# Altium project Prueba.PrjPcb
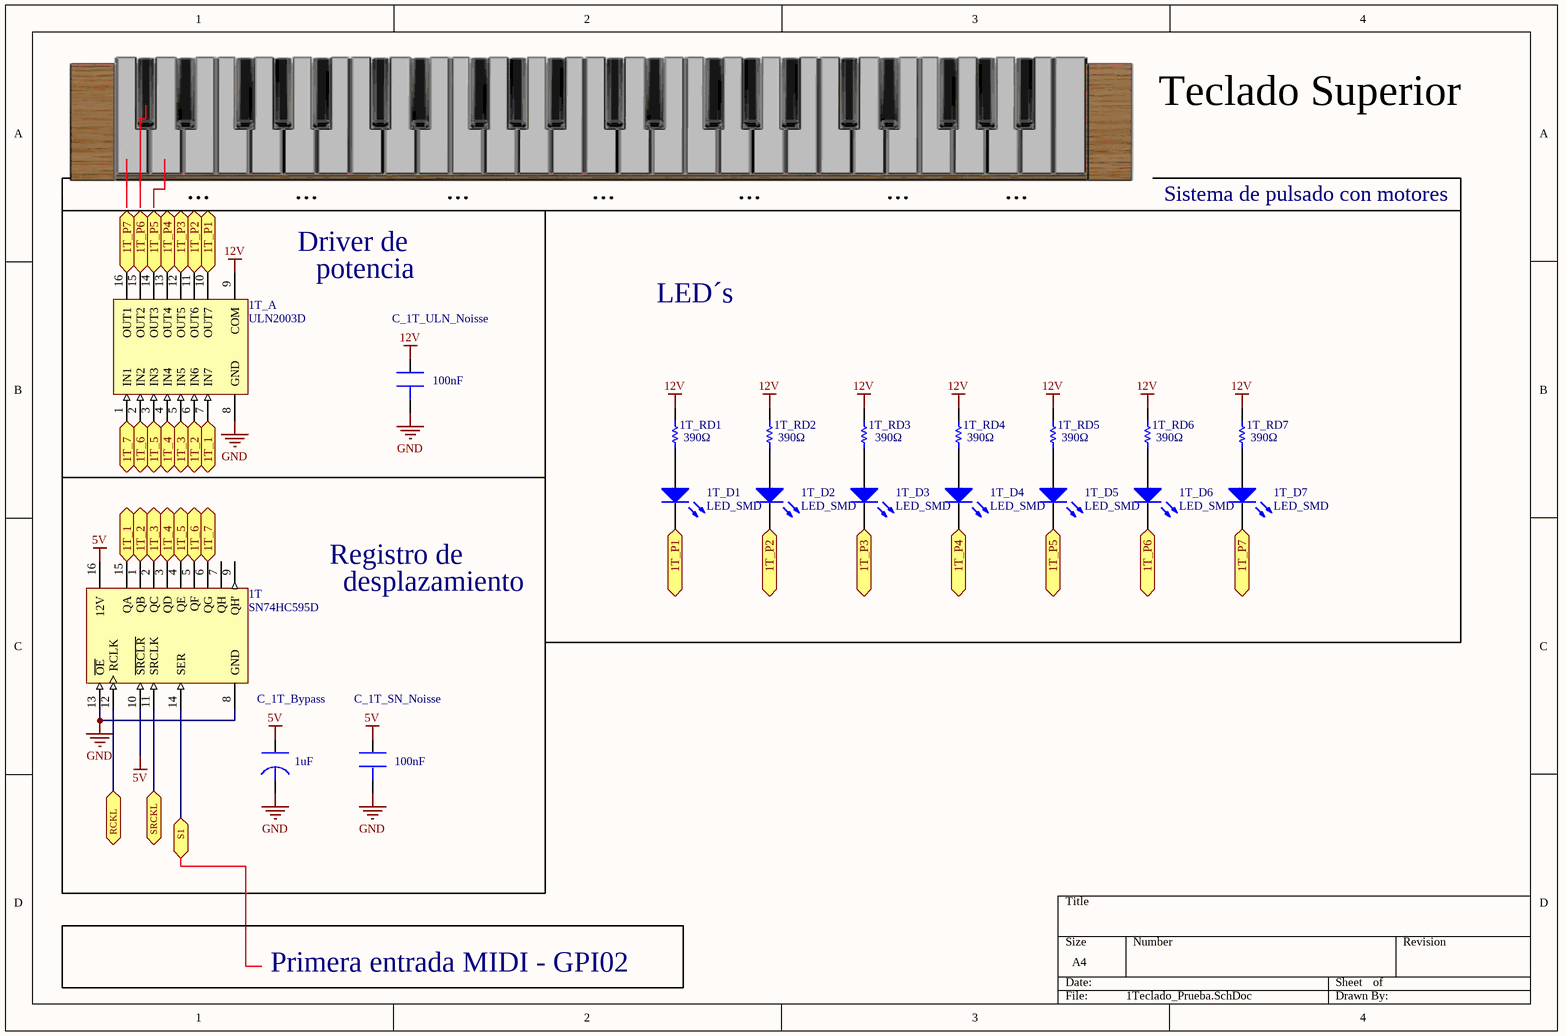
[diagram p0: 1Teclado_Prueba.SchDoc]
6 sheets, 91 parts. Net scope: flat (ports and power ports of the same name join across sheets).
Board file: PCB_Organo_Prueba_V3.PcbDoc
Sheets:
  1Teclado_Prueba.SchDoc
  2Teclado_Prueba.SchDoc
  Valvulas_Prueba.SchDoc
  Pedal_Prueba.SchDoc
  Externos_prueba.SchDoc
  GPIO_Raspberry_b+.SchDoc

## Sheet 1Teclado_Prueba.SchDoc
size A4

### Parts
1T  SN74HC595D  [SN74HC595D]
1T_A  ULN2003D  [ULN2003AI]
1T_D1  LED_SMD  [LED_0805]
1T_D2  LED_SMD  [LED_0805]
1T_D3  LED_SMD  [LED_0805]
1T_D4  LED_SMD  [LED_0805]
1T_D5  LED_SMD  [LED_0805]
1T_D6  LED_SMD  [LED_0805]
1T_D7  LED_SMD  [LED_0805]
1T_RD1  value 390Ω  [Resistencia_0805_N]  (hidden comment: Res Chip 0805)
1T_RD2  value 390Ω  [Resistencia_0805_N]  (hidden comment: Res Chip 0805)
1T_RD3  value 390Ω  [Resistencia_0805_N]  (hidden comment: Res Chip 0805)
1T_RD4  value 390Ω  [Resistencia_0805_N]  (hidden comment: Res Chip 0805)
1T_RD5  value 390Ω  [Resistencia_0805_N]  (hidden comment: Res Chip 0805)
1T_RD6  value 390Ω  [Resistencia_0805_N]  (hidden comment: Res Chip 0805)
1T_RD7  value 390Ω  [Resistencia_0805_N]  (hidden comment: Res Chip 0805)
C_1T_Bypass  value 1uF  [Panasonic B Size]  (hidden comment: Panasonic 1uF)
C_1T_SN_Noisse  value 100nF  [AVX Carcasa 1.206]  (hidden comment: AVX 100nF)
C_1T_ULN_Noisse  value 100nF  [AVX Carcasa 1.206]  (hidden comment: AVX 100nF)

### Ports
1T_1, 1T_2, 1T_3, 1T_4, 1T_5, 1T_6, 1T_7, 1T_P1, 1T_P2, 1T_P3, 1T_P4, 1T_P5, 1T_P6, 1T_P7, RCKL, S1, SRCKL

### Nets
5V: 1T.10(~{SRCLR}) 1T.16(12V) C_1T_Bypass.1 C_1T_SN_Noisse.1
12V: 1T_A.9(COM) 1T_RD1.2 1T_RD2.2 1T_RD3.2 1T_RD4.2 1T_RD5.2 1T_RD6.2 1T_RD7.2 C_1T_ULN_Noisse.1
GND: 1T.8(GND) 1T.13(~{OE}) 1T_A.8(GND) C_1T_Bypass.2 C_1T_SN_Noisse.2 C_1T_ULN_Noisse.2
Net1T_1: 1T.1(QB) 1T_A.6(IN6) ; port 1T_2
Net1T_2: 1T.2(QC) 1T_A.5(IN5) ; port 1T_3
Net1T_3: 1T.3(QD) 1T_A.4(IN4) ; port 1T_4
Net1T_4: 1T.4(QE) 1T_A.3(IN3) ; port 1T_5
Net1T_5: 1T.5(QF) 1T_A.2(IN2) ; port 1T_6
Net1T_6: 1T.6(QG) 1T_A.1(IN1) ; port 1T_7
Net1T_11: 1T.11(SRCLK) ; port SRCKL
Net1T_12: 1T.12(RCLK) ; port RCKL
Net1T_14: 1T.14(SER) ; port S1
Net1T_15: 1T.15(QA) 1T_A.7(IN7) ; port 1T_1
Net1T_A_10: 1T_A.10(OUT7) 1T_D1.2(K) ; port 1T_P1
Net1T_A_11: 1T_A.11(OUT6) 1T_D2.2(K) ; port 1T_P2
Net1T_A_12: 1T_A.12(OUT5) 1T_D3.2(K) ; port 1T_P3
Net1T_A_13: 1T_A.13(OUT4) 1T_D4.2(K) ; port 1T_P4
Net1T_A_14: 1T_A.14(OUT3) 1T_D5.2(K) ; port 1T_P5
Net1T_A_15: 1T_A.15(OUT2) 1T_D6.2(K) ; port 1T_P6
Net1T_A_16: 1T_A.16(OUT1) 1T_D7.2(K) ; port 1T_P7
Net1T_D1_1: 1T_D1.1(A) 1T_RD1.1
Net1T_D2_1: 1T_D2.1(A) 1T_RD2.1
Net1T_D3_1: 1T_D3.1(A) 1T_RD3.1
Net1T_D4_1: 1T_D4.1(A) 1T_RD4.1
Net1T_D5_1: 1T_D5.1(A) 1T_RD5.1
Net1T_D6_1: 1T_D6.1(A) 1T_RD6.1
Net1T_D7_1: 1T_D7.1(A) 1T_RD7.1

Not connected (* = marked no-connect by the designer): 1T 7(QH) 9(QH')

### Notes on the sheet
- Teclado Superior
- ...
- Sistema de pulsado con motores
- Driver de
- potencia
- LED´s
- Registro de
- desplazamiento
- Primera entrada MIDI - GPI02

### Library data of the parts
1T = SN74HC595D: 8-Bit Shift Register with 3-State Output Registers; Published: 8-Jun-2000; LatestRevisionDate: 13-Apr-2006; LatestRevisionNote: IPC-7351 Footprint Added.; DatasheetVersion: May-1997; PackageVersion: Jan-1998; PackageReference: D016; Publisher: Altium Limited; PackageDescription: 16-Pin Small Outline Integrated Circuit 1.27 mm Pitch; Code_IPC: SOIC127P600-16; ComponentLink1Description: Manufacturer Link; ComponentLink1URL: http://www.ti.com/; ComponentLink2Description: Datasheet; ComponentLink2URL: http://www-s.ti.com/sc/ds/sn74hc595.pdf
1T_A = ULN2003D: Seven Darlington Array; Published: 8-Jun-2000; LatestRevisionDate: 13-Apr-2006; LatestRevisionNote: IPC-7351 Footprint Added.; DatasheetVersion: Sep-1998; PackageVersion: May-1998; PackageReference: SO16; Publisher: Altium Limited; PackageDescription: 16-Pin Small Outline Integrated Circuit 1.27 mm Pitch; Code_IPC: SOIC127P600-16; ComponentLink1Description: Manufacturer Link; ComponentLink1URL: http://www.st.com/; ComponentLink2Description: Datasheet; ComponentLink2URL: http://www.st.com/stonline/products/literature/ds/5279/uln2001.pdf
1T_D1-1T_D7 = LED_SMD: LED SMD; Published: 8-Jun-2000; LatestRevisionDate: 08-Jul-2005; LatestRevisionNote: Mech Layer 1 removed.; PackageReference: LED-0; Publisher: Altium Limited
1T_RD1-1T_RD7 = Resistencia: Published: 8-Jun-2000; LatestRevisionDate: 17-Jul-2002; LatestRevisionNote: Re-released for DXP Platform.; PackageReference: AXIAL-0.3; Publisher: Altium Limited; PackageDescription: Axial Device, Thru-Hole; 2 Leads; 0.3 in Pin Spacing
C_1T_Bypass = Panasonic 1uF: Condensador Electrolítico SMD; Manufacturer #1: Nippon Chemi-Con; Part Number: EMV-500ADA101MJA0G; Tolerance: 20%; Ref. Mafero: 230; Voltage Rating: 50V; PCB DECAL: Panasonic B; Author: Jaime Jiménez Ortega; Cost: 0,718€; Date: 21/05/2009; Distributor: RS; Ref Distributor: 5479063
C_1T_SN_Noisse C_1T_ULN_Noisse = AVX 100nF: Condensador Cerámico SMD; Manufacturer #1: Nippon Chemi-Con; Part Number: EMV-500ADA101MJA0G; Tolerance: 20%; Ref. Mafero: 230; Voltage Rating: 50V; Author: Jaime Jiménez Ortega; Cost: 0,718€; Date: 21/05/2009; Distributor: RS; Ref Distributor: 5479063; PCB DECAL: AVX 1206

## Sheet 2Teclado_Prueba.SchDoc
size A4
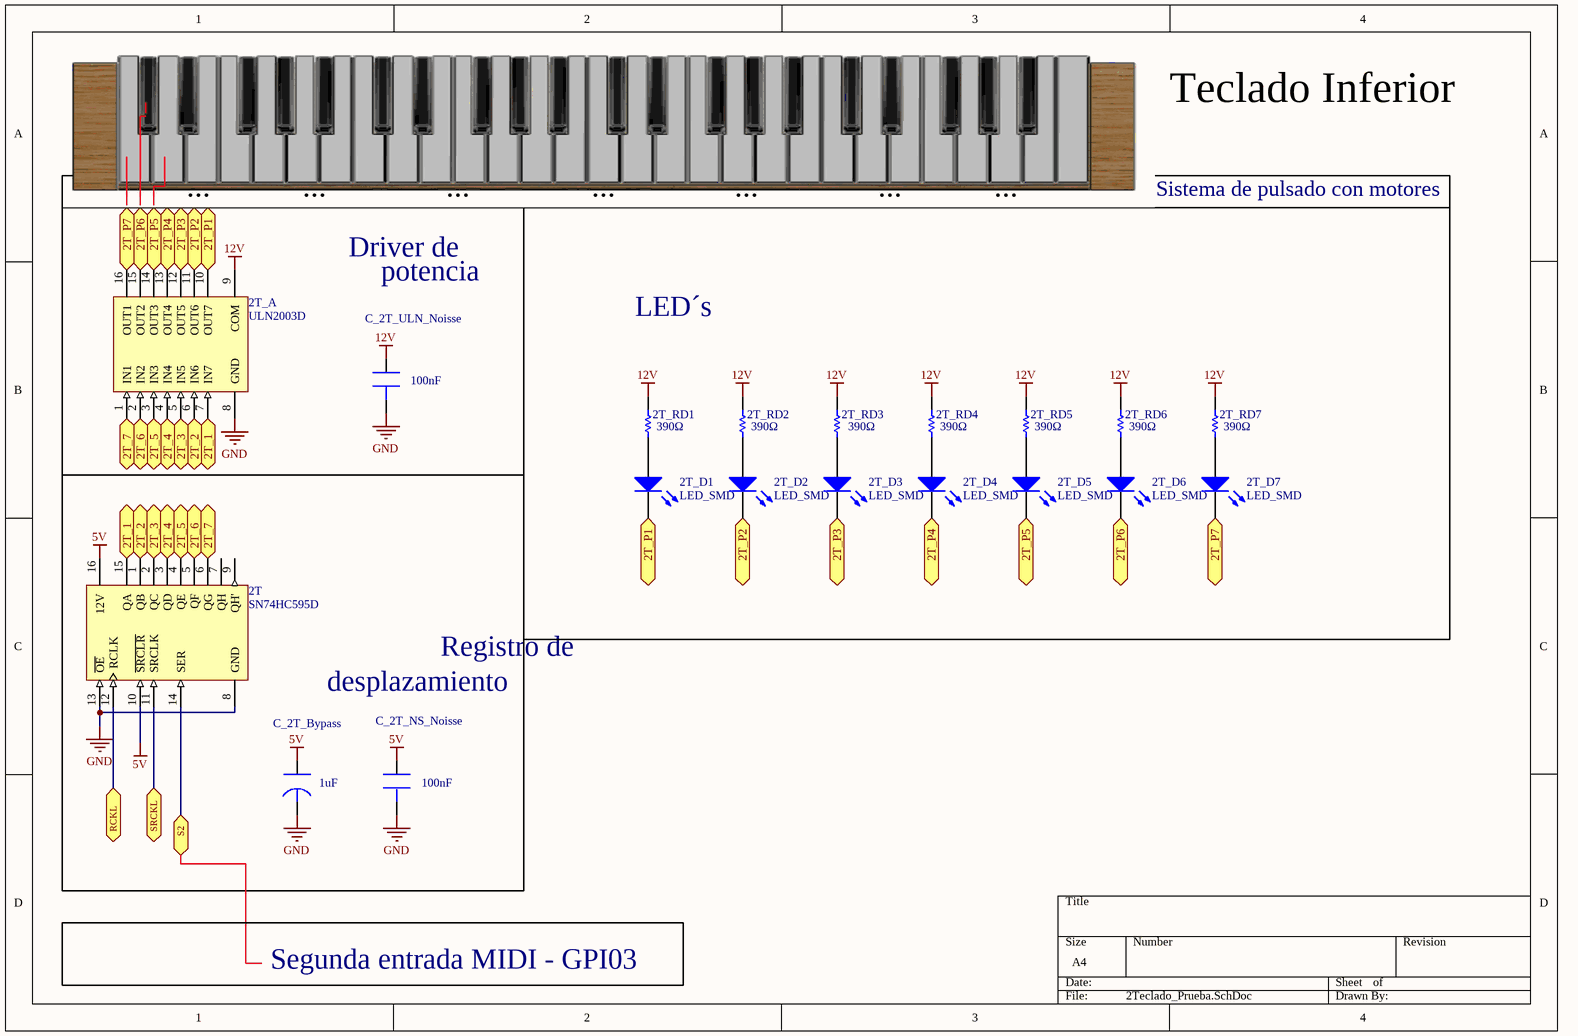
[diagram p1: 2Teclado_Prueba.SchDoc]

### Parts
2T  SN74HC595D  [SN74HC595D]
2T_A  ULN2003D  [ULN2003AI]
2T_D1  LED_SMD  [LED_0805]
2T_D2  LED_SMD  [LED_0805]
2T_D3  LED_SMD  [LED_0805]
2T_D4  LED_SMD  [LED_0805]
2T_D5  LED_SMD  [LED_0805]
2T_D6  LED_SMD  [LED_0805]
2T_D7  LED_SMD  [LED_0805]
2T_RD1  value 390Ω  [Resistencia_0805_N]  (hidden comment: Res Chip 0805)
2T_RD2  value 390Ω  [Resistencia_0805_N]  (hidden comment: Res Chip 0805)
2T_RD3  value 390Ω  [Resistencia_0805_N]  (hidden comment: Res Chip 0805)
2T_RD4  value 390Ω  [Resistencia_0805_N]  (hidden comment: Res Chip 0805)
2T_RD5  value 390Ω  [Resistencia_0805_N]  (hidden comment: Res Chip 0805)
2T_RD6  value 390Ω  [Resistencia_0805_N]  (hidden comment: Res Chip 0805)
2T_RD7  value 390Ω  [Resistencia_0805_N]  (hidden comment: Res Chip 0805)
C_2T_Bypass  value 1uF  [Panasonic B Size]  (hidden comment: Panasonic 1uF)
C_2T_NS_Noisse  value 100nF  [AVX Carcasa 1.206]  (hidden comment: AVX 100nF)
C_2T_ULN_Noisse  value 100nF  [AVX Carcasa 1.206]  (hidden comment: AVX 100nF)

### Ports
2T_1, 2T_2, 2T_3, 2T_4, 2T_5, 2T_6, 2T_7, 2T_P1, 2T_P2, 2T_P3, 2T_P4, 2T_P5, 2T_P6, 2T_P7, RCKL, S2, SRCKL

### Nets
5V: 2T.10(~{SRCLR}) 2T.16(12V) C_2T_Bypass.1 C_2T_NS_Noisse.1
12V: 2T_A.9(COM) 2T_RD1.2 2T_RD2.2 2T_RD3.2 2T_RD4.2 2T_RD5.2 2T_RD6.2 2T_RD7.2 C_2T_ULN_Noisse.1
GND: 2T.8(GND) 2T.13(~{OE}) 2T_A.8(GND) C_2T_Bypass.2 C_2T_NS_Noisse.2 C_2T_ULN_Noisse.2
Net1T_11: 2T.11(SRCLK) ; port SRCKL
Net1T_12: 2T.12(RCLK) ; port RCKL
Net2T_1: 2T.1(QB) 2T_A.6(IN6) ; port 2T_2
Net2T_2: 2T.2(QC) 2T_A.5(IN5) ; port 2T_3
Net2T_3: 2T.3(QD) 2T_A.4(IN4) ; port 2T_4
Net2T_4: 2T.4(QE) 2T_A.3(IN3) ; port 2T_5
Net2T_5: 2T.5(QF) 2T_A.2(IN2) ; port 2T_6
Net2T_6: 2T.6(QG) 2T_A.1(IN1) ; port 2T_7
Net2T_14: 2T.14(SER) ; port S2
Net2T_15: 2T.15(QA) 2T_A.7(IN7) ; port 2T_1
Net2T_A_10: 2T_A.10(OUT7) 2T_D1.2(K) ; port 2T_P1
Net2T_A_11: 2T_A.11(OUT6) 2T_D2.2(K) ; port 2T_P2
Net2T_A_12: 2T_A.12(OUT5) 2T_D3.2(K) ; port 2T_P3
Net2T_A_13: 2T_A.13(OUT4) 2T_D4.2(K) ; port 2T_P4
Net2T_A_14: 2T_A.14(OUT3) 2T_D5.2(K) ; port 2T_P5
Net2T_A_15: 2T_A.15(OUT2) 2T_D6.2(K) ; port 2T_P6
Net2T_A_16: 2T_A.16(OUT1) 2T_D7.2(K) ; port 2T_P7
Net2T_D1_1: 2T_D1.1(A) 2T_RD1.1
Net2T_D2_1: 2T_D2.1(A) 2T_RD2.1
Net2T_D3_1: 2T_D3.1(A) 2T_RD3.1
Net2T_D4_1: 2T_D4.1(A) 2T_RD4.1
Net2T_D5_1: 2T_D5.1(A) 2T_RD5.1
Net2T_D6_1: 2T_D6.1(A) 2T_RD6.1
Net2T_D7_1: 2T_D7.1(A) 2T_RD7.1

Not connected (* = marked no-connect by the designer): 2T 7(QH) 9(QH')

### Notes on the sheet
- Teclado Inferior
- ...
- Sistema de pulsado con motores
- Driver de
- potencia
- LED´s
- desplazamiento
- (near 2T) Registro de
- Segunda entrada MIDI - GPI03

### Library data of the parts
2T = SN74HC595D: as 1T on sheet 1Teclado_Prueba; Published: 8-Jun-2000; LatestRevisionDate: 13-Apr-2006; LatestRevisionNote: IPC-7351 Footprint Added.; DatasheetVersion: May-1997; PackageVersion: Jan-1998; PackageReference: D016; Publisher: Altium Limited; PackageDescription: 16-Pin Small Outline Integrated Circuit 1.27 mm Pitch; Code_IPC: SOIC127P600-16; ComponentLink1Description: Manufacturer Link; ComponentLink1URL: http://www.ti.com/; ComponentLink2Description: Datasheet; ComponentLink2URL: http://www-s.ti.com/sc/ds/sn74hc595.pdf
2T_A = ULN2003D: Seven Darlington Array; Published: 8-Jun-2000; LatestRevisionDate: 13-Apr-2006; LatestRevisionNote: IPC-7351 Footprint Added.; DatasheetVersion: Sep-1998; PackageVersion: May-1998; PackageReference: SO16; Publisher: Altium Limited; PackageDescription: 16-Pin Small Outline Integrated Circuit 1.27 mm Pitch; Code_IPC: SOIC127P600-16; ComponentLink1Description: Manufacturer Link; ComponentLink1URL: http://www.st.com/; ComponentLink2Description: Datasheet; ComponentLink2URL: http://www.st.com/stonline/products/literature/ds/5279/uln2001.pdf
2T_D1-2T_D7 = LED_SMD: LED SMD; Published: 8-Jun-2000; LatestRevisionDate: 08-Jul-2005; LatestRevisionNote: Mech Layer 1 removed.; PackageReference: LED-0; Publisher: Altium Limited
2T_RD1-2T_RD7 = Resistencia: Published: 8-Jun-2000; LatestRevisionDate: 17-Jul-2002; LatestRevisionNote: Re-released for DXP Platform.; PackageReference: AXIAL-0.3; Publisher: Altium Limited; PackageDescription: Axial Device, Thru-Hole; 2 Leads; 0.3 in Pin Spacing
C_2T_Bypass = Panasonic 1uF: as C_1T_Bypass on sheet 1Teclado_Prueba; Author: Jaime Jiménez Ortega; Cost: 0,718€; Date: 21/05/2009; Distributor: RS; Ref Distributor: 5479063
C_2T_NS_Noisse C_2T_ULN_Noisse = AVX 100nF: as C_1T_SN_Noisse on sheet 1Teclado_Prueba; Author: Jaime Jiménez Ortega; Cost: 0,718€; Date: 21/05/2009; Distributor: RS; Ref Distributor: 5479063; PCB DECAL: AVX 1206

## Sheet Valvulas_Prueba.SchDoc
size A4
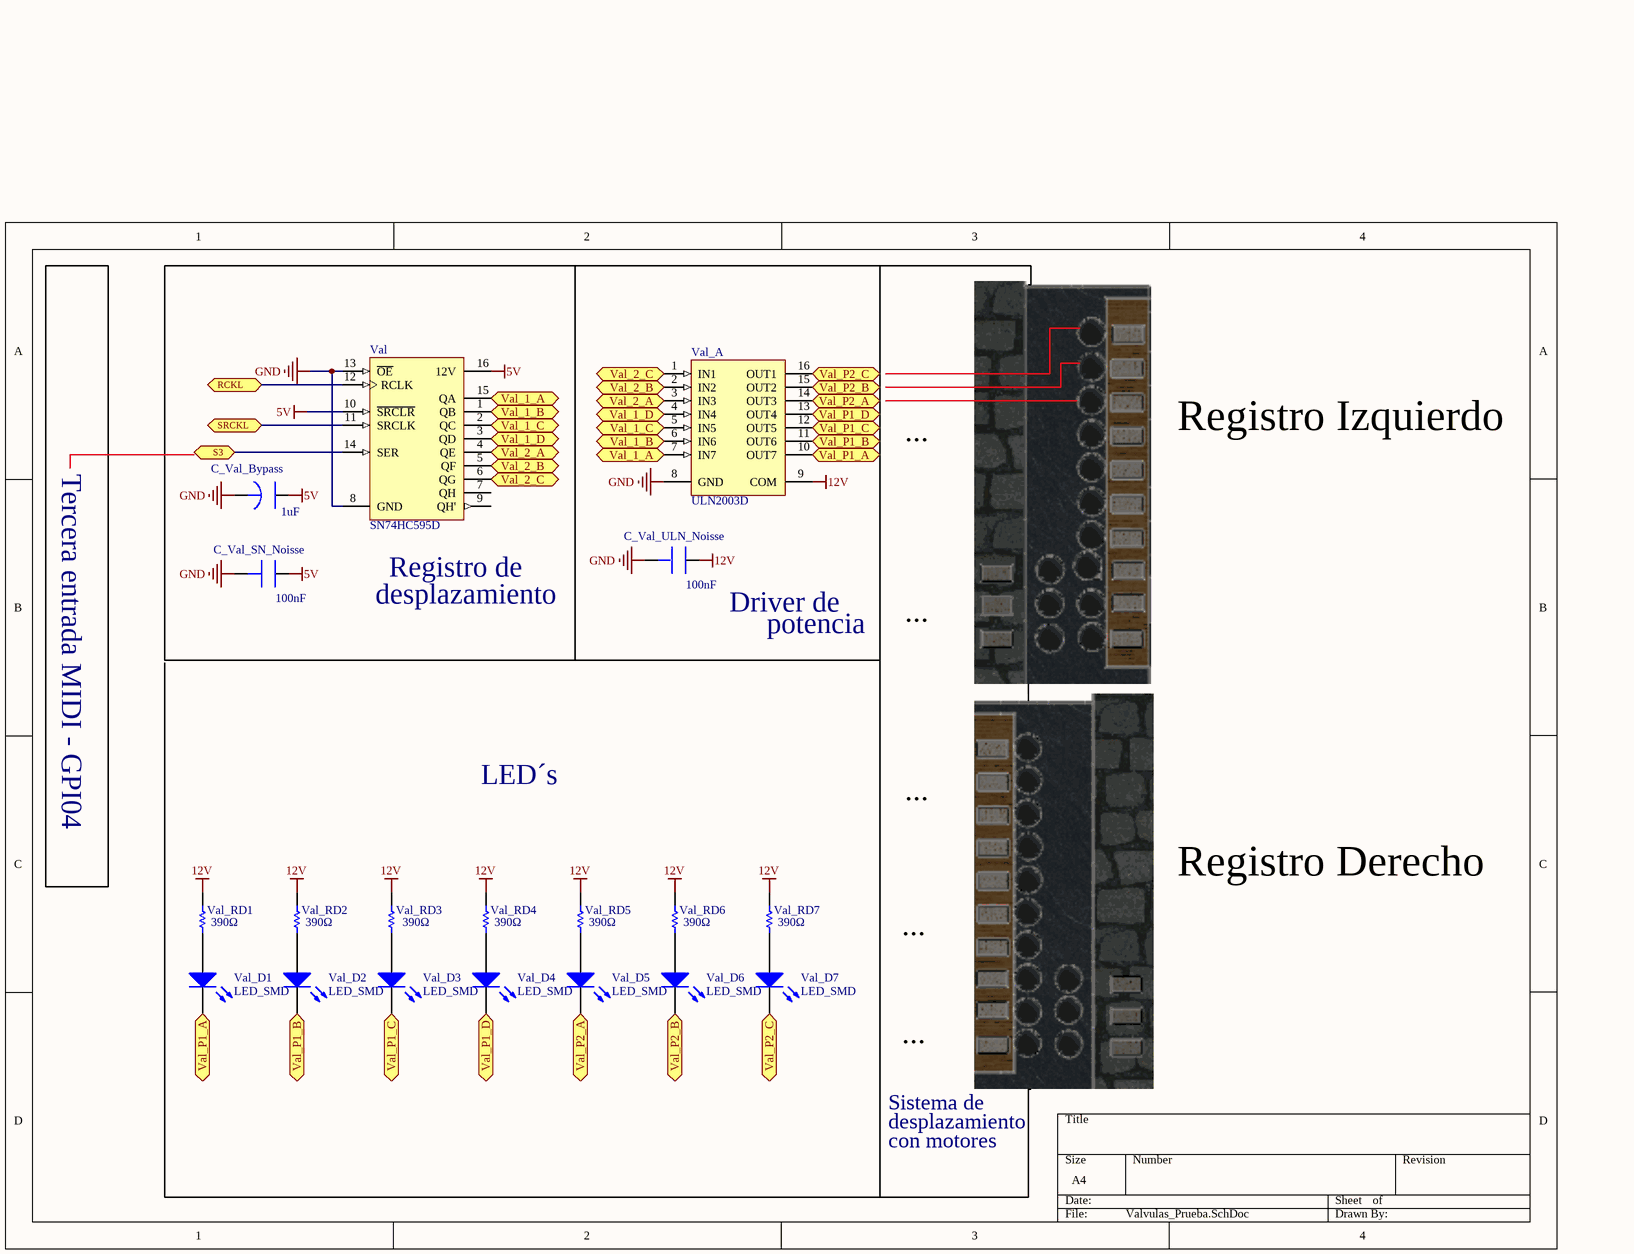
[diagram p2: Valvulas_Prueba.SchDoc]

### Parts
C_Val_Bypass  value 1uF  [Panasonic B Size]  (hidden comment: Panasonic 1uF)
C_Val_SN_Noisse  value 100nF  [AVX Carcasa 1.206]  (hidden comment: AVX 100nF)
C_Val_ULN_Noisse  value 100nF  [AVX Carcasa 1.206]  (hidden comment: AVX 100nF)
Val  SN74HC595D  [SN74HC595D]
Val_A  ULN2003D  [ULN2003AI]
Val_D1  LED_SMD  [LED_0805]
Val_D2  LED_SMD  [LED_0805]
Val_D3  LED_SMD  [LED_0805]
Val_D4  LED_SMD  [LED_0805]
Val_D5  LED_SMD  [LED_0805]
Val_D6  LED_SMD  [LED_0805]
Val_D7  LED_SMD  [LED_0805]
Val_RD1  value 390Ω  [Resistencia_0805_N]  (hidden comment: Res Chip 0805)
Val_RD2  value 390Ω  [Resistencia_0805_N]  (hidden comment: Res Chip 0805)
Val_RD3  value 390Ω  [Resistencia_0805_N]  (hidden comment: Res Chip 0805)
Val_RD4  value 390Ω  [Resistencia_0805_N]  (hidden comment: Res Chip 0805)
Val_RD5  value 390Ω  [Resistencia_0805_N]  (hidden comment: Res Chip 0805)
Val_RD6  value 390Ω  [Resistencia_0805_N]  (hidden comment: Res Chip 0805)
Val_RD7  value 390Ω  [Resistencia_0805_N]  (hidden comment: Res Chip 0805)

### Ports
RCKL, S3, SRCKL, Val_1_A, Val_1_B, Val_1_C, Val_1_D, Val_2_A, Val_2_B, Val_2_C, Val_P1_A, Val_P1_B, Val_P1_C, Val_P1_D, Val_P2_A, Val_P2_B, Val_P2_C

### Nets
5V: C_Val_Bypass.1 C_Val_SN_Noisse.1 Val.10(~{SRCLR}) Val.16(12V)
12V: C_Val_ULN_Noisse.1 Val_A.9(COM) Val_RD1.2 Val_RD2.2 Val_RD3.2 Val_RD4.2 Val_RD5.2 Val_RD6.2 Val_RD7.2
GND: C_Val_Bypass.2 C_Val_SN_Noisse.2 C_Val_ULN_Noisse.2 Val.8(GND) Val.13(~{OE}) Val_A.8(GND)
Net1T_11: Val.11(SRCLK) ; port SRCKL
Net1T_12: Val.12(RCLK) ; port RCKL
NetGPIO_7: Val.14(SER) ; port S3
NetPines_15: Val_A.10(OUT7) Val_D1.2(K) ; port Val_P1_A
NetPines_16: Val_A.11(OUT6) Val_D2.2(K) ; port Val_P1_B
NetPines_17: Val_A.12(OUT5) Val_D3.2(K) ; port Val_P1_C
NetPines_18: Val_A.13(OUT4) Val_D4.2(K) ; port Val_P1_D
NetPines_19: Val_A.14(OUT3) Val_D5.2(K) ; port Val_P2_A
NetPines_20: Val_A.15(OUT2) Val_D6.2(K) ; port Val_P2_B
NetPines_21: Val_A.16(OUT1) Val_D7.2(K) ; port Val_P2_C
NetVal_1: Val.1(QB) Val_A.6(IN6) ; port Val_1_B
NetVal_2: Val.2(QC) Val_A.5(IN5) ; port Val_1_C
NetVal_3: Val.3(QD) Val_A.4(IN4) ; port Val_1_D
NetVal_4: Val.4(QE) Val_A.3(IN3) ; port Val_2_A
NetVal_5: Val.5(QF) Val_A.2(IN2) ; port Val_2_B
NetVal_6: Val.6(QG) Val_A.1(IN1) ; port Val_2_C
NetVal_15: Val.15(QA) Val_A.7(IN7) ; port Val_1_A
NetVal_D1_1: Val_D1.1(A) Val_RD1.1
NetVal_D2_1: Val_D2.1(A) Val_RD2.1
NetVal_D3_1: Val_D3.1(A) Val_RD3.1
NetVal_D4_1: Val_D4.1(A) Val_RD4.1
NetVal_D5_1: Val_D5.1(A) Val_RD5.1
NetVal_D6_1: Val_D6.1(A) Val_RD6.1
NetVal_D7_1: Val_D7.1(A) Val_RD7.1

Not connected (* = marked no-connect by the designer): Val 7(QH) 9(QH')

### Notes on the sheet
- ...
- Registro Izquierdo
- Tercera entrada MIDI - GPI04
- (near Val) Registro de
- desplazamiento
- (near C_Val_ULN_Noisse) Driver de
- potencia
- LED´s
- Registro Derecho
- Sistema de
- con motores

### Library data of the parts
C_Val_Bypass = Panasonic 1uF: as C_1T_Bypass on sheet 1Teclado_Prueba; Author: Jaime Jiménez Ortega; Cost: 0,718€; Date: 21/05/2009; Distributor: RS; Ref Distributor: 5479063
C_Val_SN_Noisse C_Val_ULN_Noisse = AVX 100nF: as C_1T_SN_Noisse on sheet 1Teclado_Prueba; Author: Jaime Jiménez Ortega; Cost: 0,718€; Date: 21/05/2009; Distributor: RS; Ref Distributor: 5479063; PCB DECAL: AVX 1206
Val = SN74HC595D: as 1T on sheet 1Teclado_Prueba; Published: 8-Jun-2000; LatestRevisionDate: 13-Apr-2006; LatestRevisionNote: IPC-7351 Footprint Added.; DatasheetVersion: May-1997; PackageVersion: Jan-1998; PackageReference: D016; Publisher: Altium Limited; PackageDescription: 16-Pin Small Outline Integrated Circuit 1.27 mm Pitch; Code_IPC: SOIC127P600-16; ComponentLink1Description: Manufacturer Link; ComponentLink1URL: http://www.ti.com/; ComponentLink2Description: Datasheet; ComponentLink2URL: http://www-s.ti.com/sc/ds/sn74hc595.pdf
Val_A = ULN2003D: Seven Darlington Array; Published: 8-Jun-2000; LatestRevisionDate: 13-Apr-2006; LatestRevisionNote: IPC-7351 Footprint Added.; DatasheetVersion: Sep-1998; PackageVersion: May-1998; PackageReference: SO16; Publisher: Altium Limited; PackageDescription: 16-Pin Small Outline Integrated Circuit 1.27 mm Pitch; Code_IPC: SOIC127P600-16; ComponentLink1Description: Manufacturer Link; ComponentLink1URL: http://www.st.com/; ComponentLink2Description: Datasheet; ComponentLink2URL: http://www.st.com/stonline/products/literature/ds/5279/uln2001.pdf
Val_D1-Val_D7 = LED_SMD: LED SMD; Published: 8-Jun-2000; LatestRevisionDate: 08-Jul-2005; LatestRevisionNote: Mech Layer 1 removed.; PackageReference: LED-0; Publisher: Altium Limited
Val_RD1-Val_RD7 = Resistencia: Published: 8-Jun-2000; LatestRevisionDate: 17-Jul-2002; LatestRevisionNote: Re-released for DXP Platform.; PackageReference: AXIAL-0.3; Publisher: Altium Limited; PackageDescription: Axial Device, Thru-Hole; 2 Leads; 0.3 in Pin Spacing

## Sheet Pedal_Prueba.SchDoc
size A4
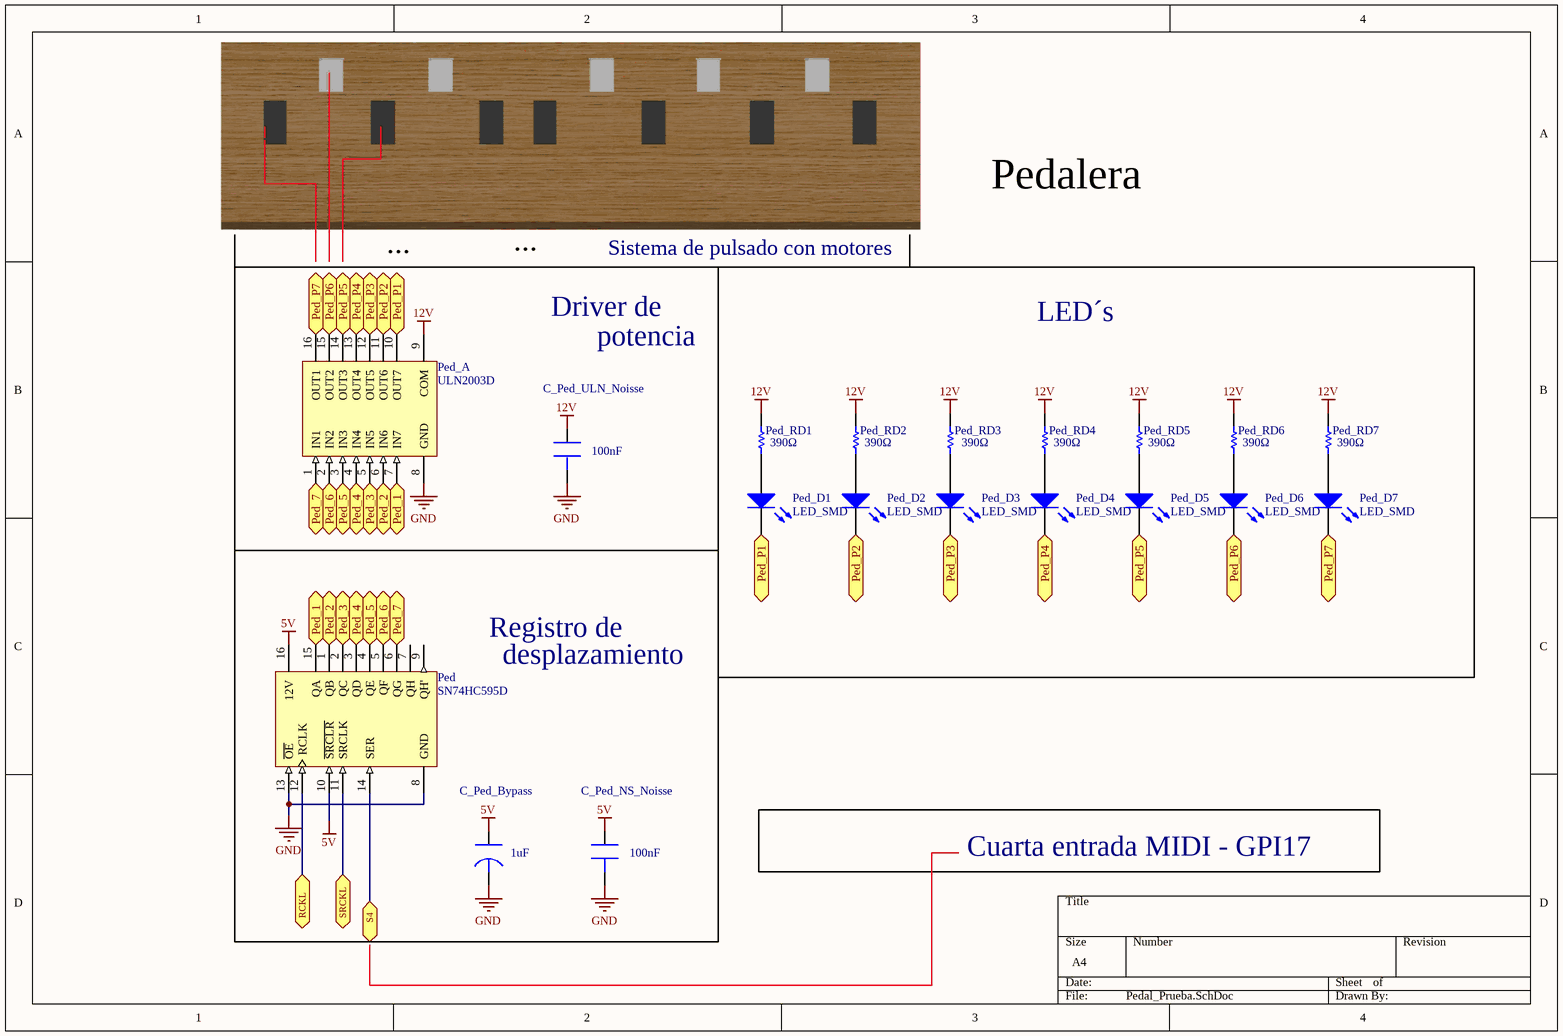
[diagram p3: Pedal_Prueba.SchDoc]

### Parts
C_Ped_Bypass  value 1uF  [Panasonic B Size]  (hidden comment: Panasonic 1uF)
C_Ped_NS_Noisse  value 100nF  [AVX Carcasa 1.206]  (hidden comment: AVX 100nF)
C_Ped_ULN_Noisse  value 100nF  [AVX Carcasa 1.206]  (hidden comment: AVX 100nF)
Ped  SN74HC595D  [SN74HC595D]
Ped_A  ULN2003D  [ULN2003AI]
Ped_D1  LED_SMD  [LED_0805]
Ped_D2  LED_SMD  [LED_0805]
Ped_D3  LED_SMD  [LED_0805]
Ped_D4  LED_SMD  [LED_0805]
Ped_D5  LED_SMD  [LED_0805]
Ped_D6  LED_SMD  [LED_0805]
Ped_D7  LED_SMD  [LED_0805]
Ped_RD1  value 390Ω  [Resistencia_0805_N]  (hidden comment: Res Chip 0805)
Ped_RD2  value 390Ω  [Resistencia_0805_N]  (hidden comment: Res Chip 0805)
Ped_RD3  value 390Ω  [Resistencia_0805_N]  (hidden comment: Res Chip 0805)
Ped_RD4  value 390Ω  [Resistencia_0805_N]  (hidden comment: Res Chip 0805)
Ped_RD5  value 390Ω  [Resistencia_0805_N]  (hidden comment: Res Chip 0805)
Ped_RD6  value 390Ω  [Resistencia_0805_N]  (hidden comment: Res Chip 0805)
Ped_RD7  value 390Ω  [Resistencia_0805_N]  (hidden comment: Res Chip 0805)

### Ports
Ped_1, Ped_2, Ped_3, Ped_4, Ped_5, Ped_6, Ped_7, Ped_P1, Ped_P2, Ped_P3, Ped_P4, Ped_P5, Ped_P6, Ped_P7, RCKL, S4, SRCKL

### Nets
5V: C_Ped_Bypass.1 C_Ped_NS_Noisse.1 Ped.10(~{SRCLR}) Ped.16(12V)
12V: C_Ped_ULN_Noisse.1 Ped_A.9(COM) Ped_RD1.2 Ped_RD2.2 Ped_RD3.2 Ped_RD4.2 Ped_RD5.2 Ped_RD6.2 Ped_RD7.2
GND: C_Ped_Bypass.2 C_Ped_NS_Noisse.2 C_Ped_ULN_Noisse.2 Ped.8(GND) Ped.13(~{OE}) Ped_A.8(GND)
Net1T_11: Ped.11(SRCLK) ; port SRCKL
Net1T_12: Ped.12(RCLK) ; port RCKL
NetGPIO_11: Ped.14(SER) ; port S4
NetPed_1: Ped.1(QB) Ped_A.6(IN6) ; port Ped_2
NetPed_2: Ped.2(QC) Ped_A.5(IN5) ; port Ped_3
NetPed_3: Ped.3(QD) Ped_A.4(IN4) ; port Ped_4
NetPed_4: Ped.4(QE) Ped_A.3(IN3) ; port Ped_5
NetPed_5: Ped.5(QF) Ped_A.2(IN2) ; port Ped_6
NetPed_6: Ped.6(QG) Ped_A.1(IN1) ; port Ped_7
NetPed_15: Ped.15(QA) Ped_A.7(IN7) ; port Ped_1
NetPed_A_10: Ped_A.10(OUT7) Ped_D1.2(K) ; port Ped_P1
NetPed_A_11: Ped_A.11(OUT6) Ped_D2.2(K) ; port Ped_P2
NetPed_A_12: Ped_A.12(OUT5) Ped_D3.2(K) ; port Ped_P3
NetPed_A_13: Ped_A.13(OUT4) Ped_D4.2(K) ; port Ped_P4
NetPed_A_14: Ped_A.14(OUT3) Ped_D5.2(K) ; port Ped_P5
NetPed_A_15: Ped_A.15(OUT2) Ped_D6.2(K) ; port Ped_P6
NetPed_A_16: Ped_A.16(OUT1) Ped_D7.2(K) ; port Ped_P7
NetPed_D1_1: Ped_D1.1(A) Ped_RD1.1
NetPed_D2_1: Ped_D2.1(A) Ped_RD2.1
NetPed_D3_1: Ped_D3.1(A) Ped_RD3.1
NetPed_D4_1: Ped_D4.1(A) Ped_RD4.1
NetPed_D5_1: Ped_D5.1(A) Ped_RD5.1
NetPed_D6_1: Ped_D6.1(A) Ped_RD6.1
NetPed_D7_1: Ped_D7.1(A) Ped_RD7.1

Not connected (* = marked no-connect by the designer): Ped 7(QH) 9(QH')

### Notes on the sheet
- Pedalera
- ...
- Sistema de pulsado con motores
- Driver de
- potencia
- LED´s
- Registro de
- desplazamiento
- Cuarta entrada MIDI - GPI17

### Library data of the parts
C_Ped_Bypass = Panasonic 1uF: as C_1T_Bypass on sheet 1Teclado_Prueba; Author: Jaime Jiménez Ortega; Cost: 0,718€; Date: 21/05/2009; Distributor: RS; Ref Distributor: 5479063
C_Ped_NS_Noisse C_Ped_ULN_Noisse = AVX 100nF: as C_1T_SN_Noisse on sheet 1Teclado_Prueba; Author: Jaime Jiménez Ortega; Cost: 0,718€; Date: 21/05/2009; Distributor: RS; Ref Distributor: 5479063; PCB DECAL: AVX 1206
Ped = SN74HC595D: as 1T on sheet 1Teclado_Prueba; Published: 8-Jun-2000; LatestRevisionDate: 13-Apr-2006; LatestRevisionNote: IPC-7351 Footprint Added.; DatasheetVersion: May-1997; PackageVersion: Jan-1998; PackageReference: D016; Publisher: Altium Limited; PackageDescription: 16-Pin Small Outline Integrated Circuit 1.27 mm Pitch; Code_IPC: SOIC127P600-16; ComponentLink1Description: Manufacturer Link; ComponentLink1URL: http://www.ti.com/; ComponentLink2Description: Datasheet; ComponentLink2URL: http://www-s.ti.com/sc/ds/sn74hc595.pdf
Ped_A = ULN2003D: Seven Darlington Array; Published: 8-Jun-2000; LatestRevisionDate: 13-Apr-2006; LatestRevisionNote: IPC-7351 Footprint Added.; DatasheetVersion: Sep-1998; PackageVersion: May-1998; PackageReference: SO16; Publisher: Altium Limited; PackageDescription: 16-Pin Small Outline Integrated Circuit 1.27 mm Pitch; Code_IPC: SOIC127P600-16; ComponentLink1Description: Manufacturer Link; ComponentLink1URL: http://www.st.com/; ComponentLink2Description: Datasheet; ComponentLink2URL: http://www.st.com/stonline/products/literature/ds/5279/uln2001.pdf
Ped_D1-Ped_D7 = LED_SMD: LED SMD; Published: 8-Jun-2000; LatestRevisionDate: 08-Jul-2005; LatestRevisionNote: Mech Layer 1 removed.; PackageReference: LED-0; Publisher: Altium Limited
Ped_RD1-Ped_RD7 = Resistencia: Published: 8-Jun-2000; LatestRevisionDate: 17-Jul-2002; LatestRevisionNote: Re-released for DXP Platform.; PackageReference: AXIAL-0.3; Publisher: Altium Limited; PackageDescription: Axial Device, Thru-Hole; 2 Leads; 0.3 in Pin Spacing

## Sheet Externos_prueba.SchDoc
size A4
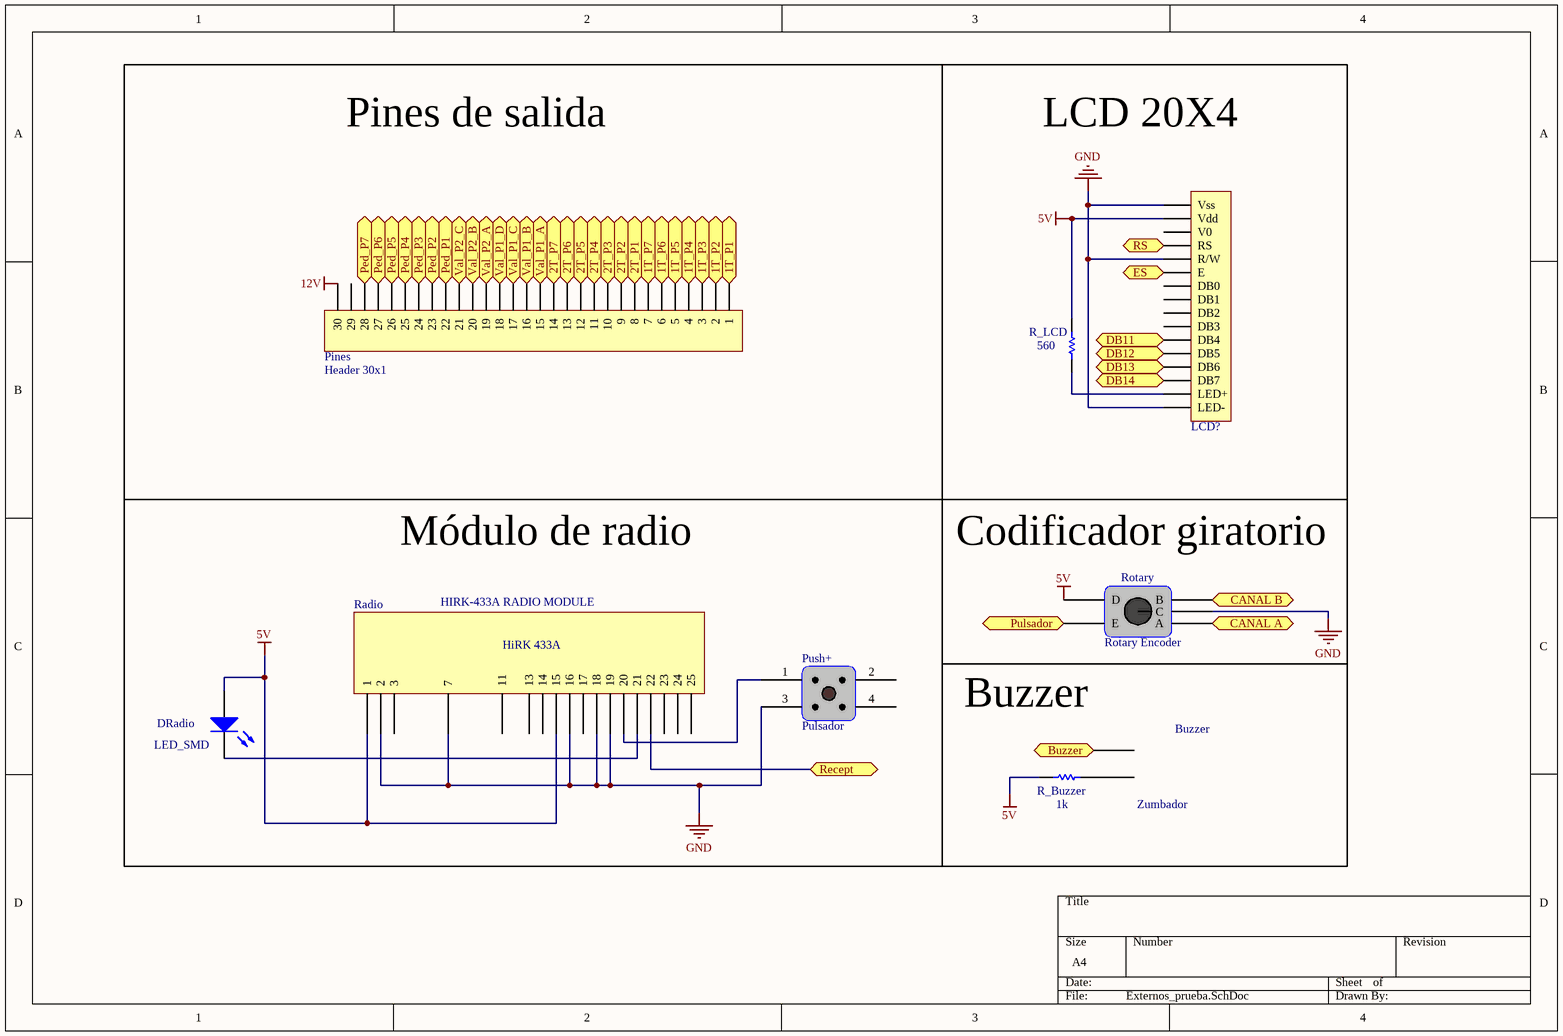
[diagram p4: Externos_prueba.SchDoc]

### Parts
DRadio  LED_SMD  [LED_0805]
LCD?  LCD 20x4  [LCD FORDATA (20x4)]  (value not drawn)
Pines  Header 30x1  [Header 1X30]
Push+  Pulsador  [Pulsador]
R_Buzzer  value 1k  [Resistencia_0805_N]  (hidden comment: Res Chip 0805)
R_LCD  value 560  [Resistencia_0805_N]  (hidden comment: Res Chip 0805)
Radio  HIRK-433A RADIO MODULE  [HIRK-433A Radio Module]
Rotary  Rotary Encoder  [RotaryPCB]
Zumbador  Buzzer  [Buzzer]  (value not drawn)

### Ports
1T_P1, 1T_P2, 1T_P3, 1T_P4, 1T_P5, 1T_P6, 1T_P7, 2T_P1, 2T_P2, 2T_P3, 2T_P4, 2T_P5, 2T_P6, 2T_P7, Buzzer, CANAL A, CANAL B, DB11, DB12, DB13, DB14, ES, Ped_P1, Ped_P2, Ped_P3, Ped_P4, Ped_P5, Ped_P6, Ped_P7, Pulsador, Recept, RS, Val_P1_A, Val_P1_B, Val_P1_C, Val_P1_D, Val_P2_A, Val_P2_B, Val_P2_C

### Nets
5V: DRadio.1(A) LCD?.2(Vdd) R_Buzzer.1 R_LCD.2 Radio.1 Radio.15 Rotary.D
12V: Pines.30
GND: LCD?.1(Vss) LCD?.5(R/W) LCD?.16(LED-) Push+.3 Radio.2 Radio.7 Radio.16 Radio.18 Radio.19 Rotary.C
Net1T_A_10: Pines.1 ; port 1T_P1
Net1T_A_11: Pines.2 ; port 1T_P2
Net1T_A_12: Pines.3 ; port 1T_P3
Net1T_A_13: Pines.4 ; port 1T_P4
Net1T_A_14: Pines.5 ; port 1T_P5
Net1T_A_15: Pines.6 ; port 1T_P6
Net1T_A_16: Pines.7 ; port 1T_P7
Net2T_A_10: Pines.8 ; port 2T_P1
Net2T_A_11: Pines.9 ; port 2T_P2
Net2T_A_12: Pines.10 ; port 2T_P3
Net2T_A_13: Pines.11 ; port 2T_P4
Net2T_A_14: Pines.12 ; port 2T_P5
Net2T_A_15: Pines.13 ; port 2T_P6
Net2T_A_16: Pines.14 ; port 2T_P7
NetDRadio_2: DRadio.2(K) Radio.21
NetGPIO_8: Rotary.A ; port CANAL A
NetGPIO_10: Rotary.B ; port CANAL B
NetGPIO_12: Rotary.E ; port Pulsador
NetGPIO_22: LCD?.14(DB7) ; port DB14
NetGPIO_24: LCD?.13(DB6) ; port DB13
NetGPIO_26: LCD?.12(DB5) ; port DB12
NetGPIO_32: LCD?.11(DB4) ; port DB11
NetGPIO_36: LCD?.6(E) ; port ES
NetGPIO_37: Radio.22 ; port Recept
NetGPIO_38: LCD?.4(RS) ; port RS
NetGPIO_40: Zumbador.1 ; port Buzzer
NetLCD?_15: LCD?.15(LED+) R_LCD.1
NetPed_A_10: Pines.22 ; port Ped_P1
NetPed_A_11: Pines.23 ; port Ped_P2
NetPed_A_12: Pines.24 ; port Ped_P3
NetPed_A_13: Pines.25 ; port Ped_P4
NetPed_A_14: Pines.26 ; port Ped_P5
NetPed_A_15: Pines.27 ; port Ped_P6
NetPed_A_16: Pines.28 ; port Ped_P7
NetPines_15: Pines.15 ; port Val_P1_A
NetPines_16: Pines.16 ; port Val_P1_B
NetPines_17: Pines.17 ; port Val_P1_C
NetPines_18: Pines.18 ; port Val_P1_D
NetPines_19: Pines.19 ; port Val_P2_A
NetPines_20: Pines.20 ; port Val_P2_B
NetPines_21: Pines.21 ; port Val_P2_C
NetPush+_1: Push+.1 Radio.20
NetR_Buzzer_2: R_Buzzer.2 Zumbador.2

Not connected (* = marked no-connect by the designer): LCD? 3(V0) 7(DB0) 8(DB1) 9(DB2) 10(DB3); Pines 29; Push+ 2 4; Radio 3 11 13 14 17 23 24 25

### Notes on the sheet
- Pines de salida
- LCD 20X4
- Módulo de radio
- (near Rotary) Codificador giratorio
- Buzzer
- (in symbol HIRK-433A RADIO MODULE) HiRK 433A

### Library data of the parts
DRadio = LED_SMD: LED SMD; Published: 8-Jun-2000; LatestRevisionDate: 08-Jul-2005; LatestRevisionNote: Mech Layer 1 removed.; PackageReference: LED-0; Publisher: Altium Limited
R_Buzzer R_LCD = Resistencia: Published: 8-Jun-2000; LatestRevisionDate: 17-Jul-2002; LatestRevisionNote: Re-released for DXP Platform.; PackageReference: AXIAL-0.3; Publisher: Altium Limited; PackageDescription: Axial Device, Thru-Hole; 2 Leads; 0.3 in Pin Spacing
LCD? = LCD 20x4: LatestRevisionDate: 17-Jul-2002; LatestRevisionNote: Re-released for DXP Platform.; Publisher: Altium Limited

## Sheet GPIO_Raspberry_b+.SchDoc
size A4
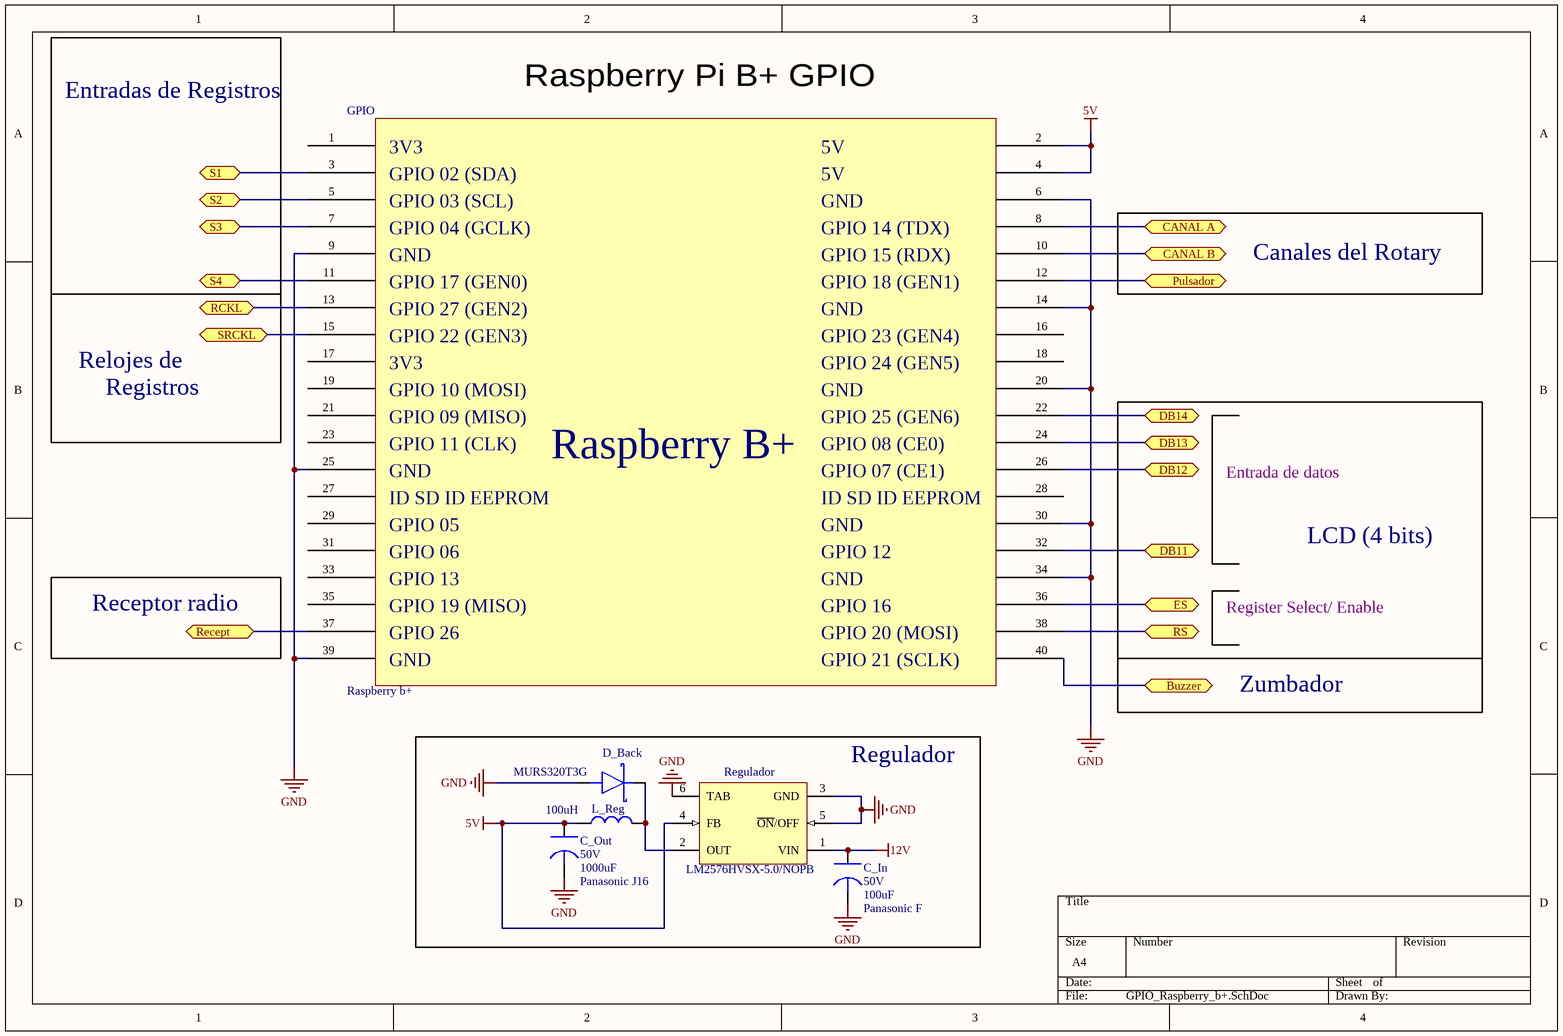
[diagram p5: GPIO_Raspberry_b+.SchDoc]

### Parts
C_In  value 100uF  Voltage Rating: 50V  PCB DECAL: Panasonic F  [Panasonic F Size]  (hidden comment: Panasonic 100uF)
C_Out  value 1000uF  Voltage Rating: 50V  PCB DECAL: Panasonic J16  [Panasonic J16 Size]  (hidden comment: Panasonic 1000uF)
D_Back  MURS320T3G  [DO-214AB]
GPIO  Raspberry b+  [Raspberry]
L_Reg  value 100uH  [DO-5040H 15uH-1400uH]  (hidden comment: DO-5040H-104ML_)
Regulador  LM2576HVSX-5.0/NOPB  [TS5B_N_]

### Blocks framed on the sheet
Regulador: C_In C_Out D_Back L_Reg Regulador

### Ports
Buzzer, CANAL A, CANAL B, DB11, DB12, DB13, DB14, ES, Pulsador, RCKL, Recept, RS, S1, S2, S3, S4, SRCKL

### Nets
5V: C_Out.1 GPIO.2 GPIO.4 L_Reg.1 Regulador.4(FB)
12V: C_In.1 Regulador.1(VIN)
GND: C_In.2 C_Out.2 D_Back.A GPIO.6 GPIO.9 GPIO.14 GPIO.20 GPIO.25 GPIO.30 GPIO.34 GPIO.39 Regulador.3(GND) Regulador.5(~{ON}/OFF) Regulador.6(TAB)
Net1T_11: GPIO.15 ; port SRCKL
Net1T_12: GPIO.13 ; port RCKL
Net1T_14: GPIO.3 ; port S1
Net2T_14: GPIO.5 ; port S2
NetD_Back_K: D_Back.K L_Reg.2 Regulador.2(OUT)
NetGPIO_7: GPIO.7 ; port S3
NetGPIO_8: GPIO.8 ; port CANAL A
NetGPIO_10: GPIO.10 ; port CANAL B
NetGPIO_11: GPIO.11 ; port S4
NetGPIO_12: GPIO.12 ; port Pulsador
NetGPIO_22: GPIO.22 ; port DB14
NetGPIO_24: GPIO.24 ; port DB13
NetGPIO_26: GPIO.26 ; port DB12
NetGPIO_32: GPIO.32 ; port DB11
NetGPIO_36: GPIO.36 ; port ES
NetGPIO_37: GPIO.37 ; port Recept
NetGPIO_38: GPIO.38 ; port RS
NetGPIO_40: GPIO.40 ; port Buzzer

Not connected (* = marked no-connect by the designer): GPIO 1 16 17 18 19 21 23 27 28 29 31 33 35

### Notes on the sheet
- (near GPIO) Entradas de Registros
- (near GPIO) Raspberry Pi B+ GPIO
- Canales del Rotary
- Relojes de
- Registros
- Entrada de datos
- LCD (4 bits)
- Receptor radio
- Register Select/ Enable
- Zumbador
- (in symbol Raspberry b+) 3V3; 5V; GPIO 02 (SDA); GPIO 03 (SCL); GND; GPIO 04 (GCLK); GPIO 14 (TDX); GPIO 15 (RDX); GPIO 17 (GEN0); GPIO 18 (GEN1); GPIO 27 (GEN2); GPIO 22 (GEN3); GPIO 23 (GEN4); GPIO 24 (GEN5); GPIO 10 (MOSI); GPIO 09 (MISO); GPIO 25 (GEN6); GPIO 11 (CLK); GPIO 08 (CE0); Raspberry B+; GPIO 07 (CE1); ID SD ID EEPROM; GPIO 05; GPIO 06; GPIO 12; GPIO 13; GPIO 19 (MISO); GPIO 16; GPIO 26; GPIO 20 (MOSI); GPIO 21 (SCLK)

### Library data of the parts
C_In = Panasonic 100uF: Condensador Electrolítico SMD; Manufacturer #1: Nippon Chemi-Con; Part Number: EMV-500ADA101MJA0G; Tolerance: 20%; Ref. Mafero: 230; Author: Jaime Jiménez Ortega; Cost: 0,718€; Date: 21/05/2009; Distributor: RS; Ref Distributor: 5479063
C_Out = Panasonic 1000uF: Condensador Electrolítico SMD; Manufacturer #1: Nippon Chemi-Con; Part Number: EMV-500ADA101MJA0G; Tolerance: 20%; Ref. Mafero: 230; Author: Jaime Jiménez Ortega; Cost: 0,718€; Date: 21/05/2009; Distributor: RS; Ref Distributor: 5479063
D_Back = MURS320T3G: Surface Mount Schottky-Rectifiers; Manufacturer #1: On Semiconductor; Ref. Mafero: 1171; Author: Jaime Jiménez Ortega; Date: 22/05/2009; Distributor: Farnell; Part Number: MURS320T3G; Ref Distributor: 9557555; PCB DECAL: DO-214AB
L_Reg = Inductor: Manufacturer #1: CoilCraft; Part Number: DO5040H-104ML_; Ref. Mafero: 1611; Author: Jaime Jiménez Ortega; Date: 22/05/2009; Distributor: Sagitron; Ref Distributor: DO5040H-104ML_; PCB DECAL: DO-5040H 15uH-1400uH
Regulador = LM2576HVSX-5.0/NOPB: SIMPLE SWITCHER® 3A Step-Down Voltage Regulator, 5-pin TO-263, Pb-Free; Manufacturer: National Semiconductor; PackageTopMarking: NSUZXYTTE#*LM2576*HVS-5.0 P+; PowerWise: N; Published: 1-Mar-2010; DatasheetVersion: Aug-2004; PackageVersion: revD, Apr-2005; PackageReference: TS5B; Publisher: Altium Limited; PackageDescription: TO-263, Molded, .400 x .390 x .180in, 5 Lead, .067in Pitch, Surface Mount; Supplier 1: Digi-Key; Supplier Part Number 1: LM2576HVSX-5.0-ND; PartNumber: LM2576HVSX-5.0/NOPB; RoHS: Y; PinCount: 5; CompType: Switcher; Code_JEDEC: MO-169-AB; ComponentLink1Description: LM2576HV Datasheet; ComponentLink1URL: http://www.national.com/ds/LM/LM2576HV.pdf; ComponentLink2Description: LM2576HV Web Page; ComponentLink2URL: http://www.national.com/pf/LM/LM2576HV.html; ComponentLink3Description: TS5B Package Page; ComponentLink3URL: http://www.national.com/packaging/folders/ts5b.html

## Nets that join several sheets
5V: 1Teclado_Prueba (1T.10 1T.16 C_1T_Bypass.1 C_1T_SN_Noisse.1), 2Teclado_Prueba (2T.10 2T.16 C_2T_Bypass.1 C_2T_NS_Noisse.1), Valvulas_Prueba (C_Val_Bypass.1 C_Val_SN_Noisse.1 Val.10 Val.16), Pedal_Prueba (C_Ped_Bypass.1 C_Ped_NS_Noisse.1 Ped.10 Ped.16), Externos_prueba (7 pins), GPIO_Raspberry_b+ (5 pins)
12V: 1Teclado_Prueba (9 pins), 2Teclado_Prueba (9 pins), Valvulas_Prueba (9 pins), Pedal_Prueba (9 pins), Externos_prueba (Pines.30), GPIO_Raspberry_b+ (C_In.1 Regulador.1)
GND: 1Teclado_Prueba (6 pins), 2Teclado_Prueba (6 pins), Valvulas_Prueba (6 pins), Pedal_Prueba (6 pins), Externos_prueba (10 pins), GPIO_Raspberry_b+ (14 pins)
Net1T_11: 1Teclado_Prueba (1T.11), 2Teclado_Prueba (2T.11), Valvulas_Prueba (Val.11), Pedal_Prueba (Ped.11), GPIO_Raspberry_b+ (GPIO.15)
Net1T_12: 1Teclado_Prueba (1T.12), 2Teclado_Prueba (2T.12), Valvulas_Prueba (Val.12), Pedal_Prueba (Ped.12), GPIO_Raspberry_b+ (GPIO.13)
Net1T_14: 1Teclado_Prueba (1T.14), GPIO_Raspberry_b+ (GPIO.3)
Net1T_A_10: 1Teclado_Prueba (1T_A.10 1T_D1.2), Externos_prueba (Pines.1)
Net1T_A_11: 1Teclado_Prueba (1T_A.11 1T_D2.2), Externos_prueba (Pines.2)
Net1T_A_12: 1Teclado_Prueba (1T_A.12 1T_D3.2), Externos_prueba (Pines.3)
Net1T_A_13: 1Teclado_Prueba (1T_A.13 1T_D4.2), Externos_prueba (Pines.4)
Net1T_A_14: 1Teclado_Prueba (1T_A.14 1T_D5.2), Externos_prueba (Pines.5)
Net1T_A_15: 1Teclado_Prueba (1T_A.15 1T_D6.2), Externos_prueba (Pines.6)
Net1T_A_16: 1Teclado_Prueba (1T_A.16 1T_D7.2), Externos_prueba (Pines.7)
Net2T_14: 2Teclado_Prueba (2T.14), GPIO_Raspberry_b+ (GPIO.5)
Net2T_A_10: 2Teclado_Prueba (2T_A.10 2T_D1.2), Externos_prueba (Pines.8)
Net2T_A_11: 2Teclado_Prueba (2T_A.11 2T_D2.2), Externos_prueba (Pines.9)
Net2T_A_12: 2Teclado_Prueba (2T_A.12 2T_D3.2), Externos_prueba (Pines.10)
Net2T_A_13: 2Teclado_Prueba (2T_A.13 2T_D4.2), Externos_prueba (Pines.11)
Net2T_A_14: 2Teclado_Prueba (2T_A.14 2T_D5.2), Externos_prueba (Pines.12)
Net2T_A_15: 2Teclado_Prueba (2T_A.15 2T_D6.2), Externos_prueba (Pines.13)
Net2T_A_16: 2Teclado_Prueba (2T_A.16 2T_D7.2), Externos_prueba (Pines.14)
NetGPIO_7: Valvulas_Prueba (Val.14), GPIO_Raspberry_b+ (GPIO.7)
NetGPIO_8: Externos_prueba (Rotary.A), GPIO_Raspberry_b+ (GPIO.8)
NetGPIO_10: Externos_prueba (Rotary.B), GPIO_Raspberry_b+ (GPIO.10)
NetGPIO_11: Pedal_Prueba (Ped.14), GPIO_Raspberry_b+ (GPIO.11)
NetGPIO_12: Externos_prueba (Rotary.E), GPIO_Raspberry_b+ (GPIO.12)
NetGPIO_22: Externos_prueba (LCD?.14), GPIO_Raspberry_b+ (GPIO.22)
NetGPIO_24: Externos_prueba (LCD?.13), GPIO_Raspberry_b+ (GPIO.24)
NetGPIO_26: Externos_prueba (LCD?.12), GPIO_Raspberry_b+ (GPIO.26)
NetGPIO_32: Externos_prueba (LCD?.11), GPIO_Raspberry_b+ (GPIO.32)
NetGPIO_36: Externos_prueba (LCD?.6), GPIO_Raspberry_b+ (GPIO.36)
NetGPIO_37: Externos_prueba (Radio.22), GPIO_Raspberry_b+ (GPIO.37)
NetGPIO_38: Externos_prueba (LCD?.4), GPIO_Raspberry_b+ (GPIO.38)
NetGPIO_40: Externos_prueba (Zumbador.1), GPIO_Raspberry_b+ (GPIO.40)
NetPed_A_10: Pedal_Prueba (Ped_A.10 Ped_D1.2), Externos_prueba (Pines.22)
NetPed_A_11: Pedal_Prueba (Ped_A.11 Ped_D2.2), Externos_prueba (Pines.23)
NetPed_A_12: Pedal_Prueba (Ped_A.12 Ped_D3.2), Externos_prueba (Pines.24)
NetPed_A_13: Pedal_Prueba (Ped_A.13 Ped_D4.2), Externos_prueba (Pines.25)
NetPed_A_14: Pedal_Prueba (Ped_A.14 Ped_D5.2), Externos_prueba (Pines.26)
NetPed_A_15: Pedal_Prueba (Ped_A.15 Ped_D6.2), Externos_prueba (Pines.27)
NetPed_A_16: Pedal_Prueba (Ped_A.16 Ped_D7.2), Externos_prueba (Pines.28)
NetPines_15: Valvulas_Prueba (Val_A.10 Val_D1.2), Externos_prueba (Pines.15)
NetPines_16: Valvulas_Prueba (Val_A.11 Val_D2.2), Externos_prueba (Pines.16)
NetPines_17: Valvulas_Prueba (Val_A.12 Val_D3.2), Externos_prueba (Pines.17)
NetPines_18: Valvulas_Prueba (Val_A.13 Val_D4.2), Externos_prueba (Pines.18)
NetPines_19: Valvulas_Prueba (Val_A.14 Val_D5.2), Externos_prueba (Pines.19)
NetPines_20: Valvulas_Prueba (Val_A.15 Val_D6.2), Externos_prueba (Pines.20)
NetPines_21: Valvulas_Prueba (Val_A.16 Val_D7.2), Externos_prueba (Pines.21)